# EAGLE design Coco2Composite (EAGLE 9.2.1)
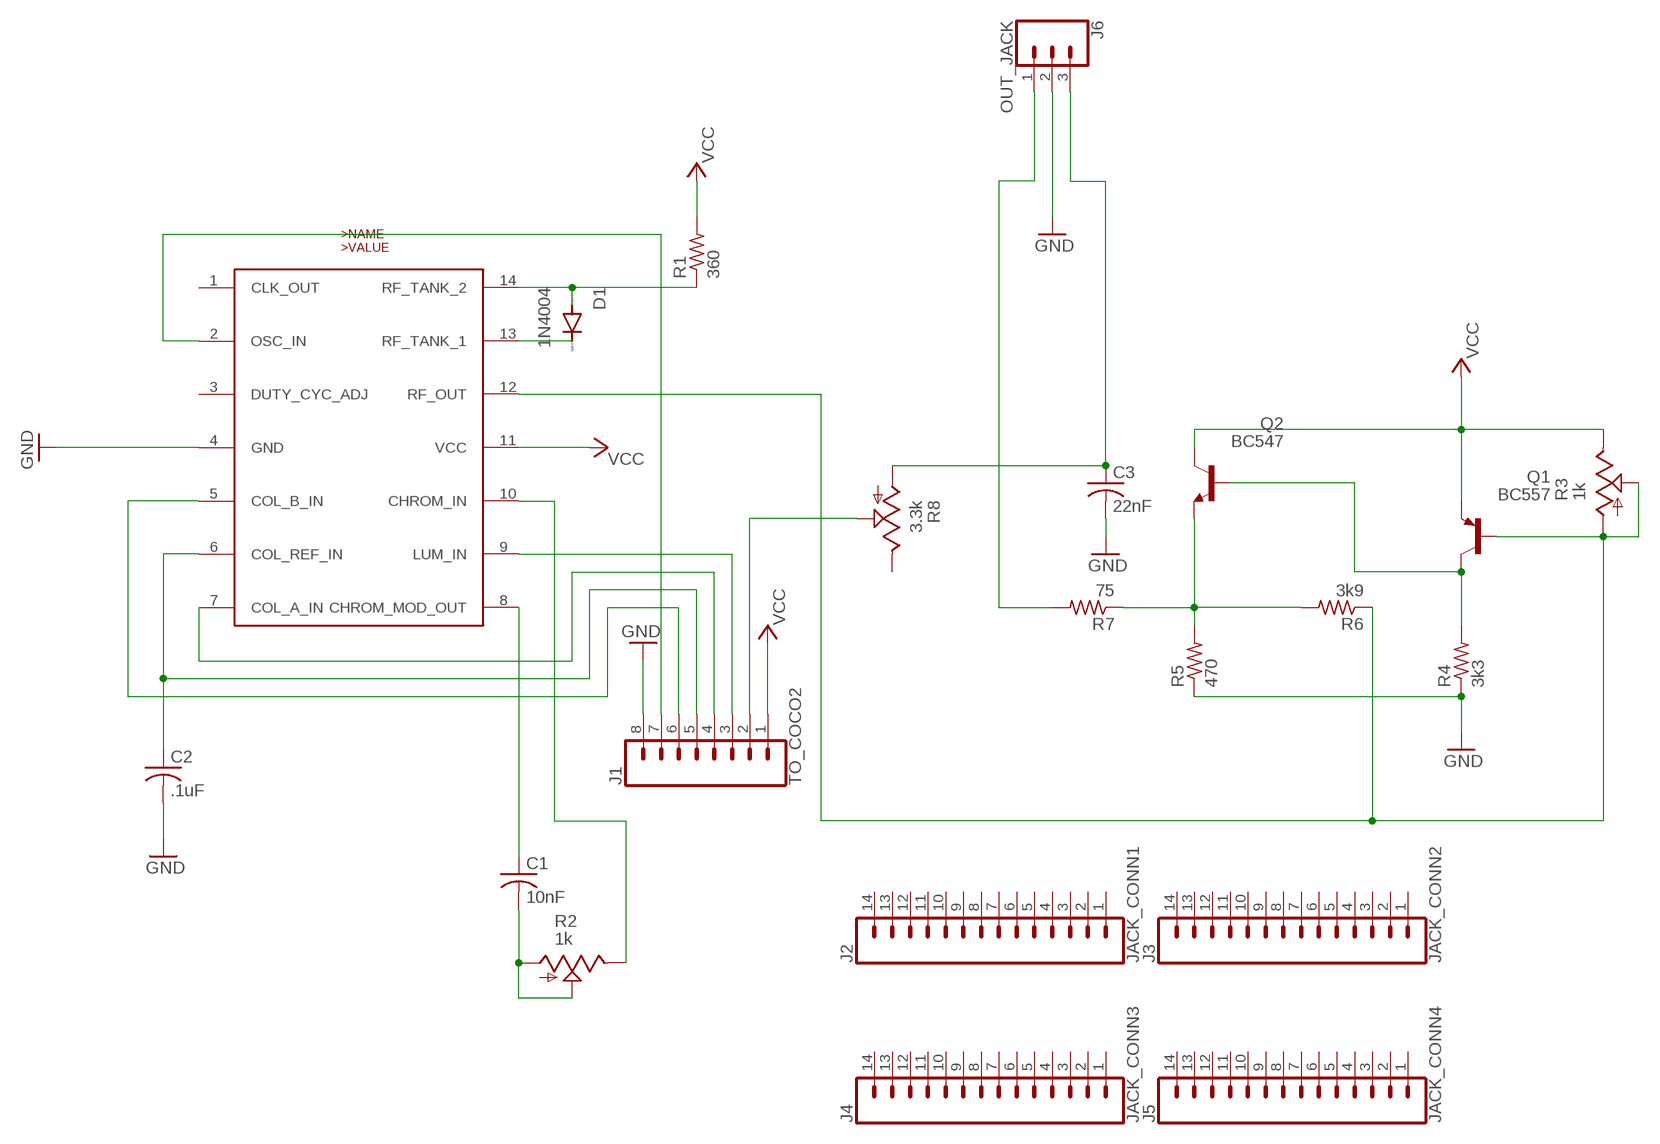
[diagram p0: schematic, sheet 1]

## Parts
C1  10nF  C-US025-024X044  [C025-024X044]
C2  .1uF  C-US025-024X044  [C025-024X044]
C3  22nF  C-US025-024X044  [C025-024X044]
D1  1N4004  [DO41-10]
J1  TO_COCO2  CONN_08"  [1X08]
J2  JACK_CONN1  CONN_14  [1X14]
J3  JACK_CONN2  CONN_14  [1X14]
J4  JACK_CONN3  CONN_14  [1X14]
J5  JACK_CONN4  CONN_14  [1X14]
J6  OUT_JACK  CONN_03  [1X03]
Q1  BC557  [TO92-EBC]
Q2  BC547  [TO92]
R1  360  R-US_0204/2V  [0204V]
R2  1k  TRIM_US-B25U  [B25U]
R3  1k  TRIM_US-B25U  [B25U]
R4  3k3  R-US_0204/2V  [0204V]
R5  470  R-US_0204/2V  [0204V]
R6  3k9  R-US_0204/2V  [0204V]
R7  75  R-US_0204/2V  [0204V]
R8  3.3k  TRIM_US-B25U  [B25U]
U1  MC1372  [DIP14]

## Nets
CHB: C2.1 J1.5 U1.6(COL_REF_IN)
CLK: J1.7 U1.2(OSC_IN)
GND: C2.2 C3.2 J1.8 J6.2 R4.1 R5.1 U1.4(GND)
N$1: D1.C U1.13(RF_TANK_1)
N$2: D1.A R1.1 U1.14(RF_TANK_2)
N$3: C1.1 U1.8(CHROM_MOD_OUT)
N$4: C1.2 R2.A R2.S
N$5: R2.E U1.10(CHROM_IN)
N$6: Q1.B R3.A R3.S R6.1 U1.12(RF_OUT)
N$7: Q1.C Q2.2(B) R4.2
N$8: Q2.1(E) R5.2 R6.2 R7.1
N$9: J6.1 R7.2
N$10: C3.1 J6.3 R8.A
PHI_A: J1.4 U1.7(COL_A_IN)
PHIB: J1.6 U1.5(COL_B_IN)
SND: J1.2 R8.S
VCC: J1.1 Q1.E Q2.3(C) R1.2 R3.E U1.11(VCC)
Y: J1.3 U1.9(LUM_IN)
Unconnected: J2.1 J2.2 J2.3 J2.4 J2.5 J2.6 J2.7 J2.8 J2.9 J2.10 J2.11 J2.12 J2.13 J2.14 J3.1 J3.2 J3.3 J3.4 J3.5 J3.6 J3.7 J3.8 J3.9 J3.10 J3.11 J3.12 J3.13 J3.14 J4.1 J4.2 J4.3 J4.4 J4.5 J4.6 J4.7 J4.8 J4.9 J4.10 J4.11 J4.12 J4.13 J4.14 J5.1 J5.2 J5.3 J5.4 J5.5 J5.6 J5.7 J5.8 J5.9 J5.10 J5.11 J5.12 J5.13 J5.14 R8.E U1.1(CLK_OUT) U1.3(DUTY_CYC_ADJ)

## Library data of the parts
C1-C3 = resistor:C-US: CAPACITOR, American symbol
D1 = diode:1N4004: DIODE general purpose rectifier, 1 A
J1 = SparkFun-Connectors:CONN_08: Multi connection point. Often used as Generic Header-pin footprint for 0.1 inch spaced/style header connections On any of the 0.1 inch spaced packages, you can populate with these: Break Away Headers - Straight <https://www.sparkfun.com/products/116> (PRT-00116) Break Away Male Headers - Right Angle <https://www.sparkfun.com/products/553> (PRT-00553) Female Headers <https://www.sparkfun.com/products/115> (PRT-00115) Break Away Headers - Machine Pin <https://www.sparkfun.com/products/117> (PRT-00117) Break Away Female Headers - Swiss Machine Pin <https://www.sparkfun.com/products/743> (PRT-00743) Arduino Stackable Header - 8 Pin <https://www.sparkfun.com/products/9279> (PRT-09279) For SCREWTERMINALS and SPRING TERMINALS visit here: Screw Terimnals on SparkFun.com <https://www.sparkfun.com/search/results?term=Screw+Terminals> (5mm/3.5mm/2.54mm spacing) This device is also useful as a general connection point to wire up your design to another part of your project. Our various solder wires solder well into these plated through hole pads. Hook-Up Wire - Assortment (Stranded, 22 AWG) <https://www.sparkfun.com/products/11375> (PRT-11375) Hook-Up Wire - Assortment (Solid Core, 22 AWG) <https://www.sparkfun.com/products/11367> (PRT-11367) View the entire wire category on our website here <https://www.sparkfun.com/categories/141> Special notes: Molex polarized connector foot print use with SKU : PRT-08231 with associated crimp pins and housings. 1MM SMD Version SKU: PRT-10208 NOTES ON THE VARIANTS LOCK and LOCK_LONGPADS... This footprint was designed to help hold the alignment of a through-hole component (i.e. 6-pin header) while soldering it into place. You may notice that each hole has been shifted either up or down by 0.005 of an inch from it's more standard position (which is a perfectly straight line). This slight alteration caused the pins (the squares in the middle) to touch the edges of the holes. Because they are alternating, it causes a "brace" to hold the component in place. 0.005 has proven to be the perfect amount of "off-center" position when using our standard breakaway headers. Although looks a little odd when you look at the bare footprint, once you have a header in there, the alteration is very hard to notice. Also,if you push a header all the way into place, it is covered up entirely on the bottom side.; PROD_ID: CONN-08438
J2-J5 = SparkFun-Connectors:CONN_14: Multi connection point. Often used as Generic Header-pin footprint for 0.1 inch spaced/style header connections On any of the 0.1 inch spaced packages, you can populate with these: Break Away Headers - Straight <https://www.sparkfun.com/products/116> (PRT-00116) Break Away Male Headers - Right Angle <https://www.sparkfun.com/products/553> (PRT-00553) Female Headers <https://www.sparkfun.com/products/115> (PRT-00115) Break Away Headers - Machine Pin <https://www.sparkfun.com/products/117> (PRT-00117) Break Away Female Headers - Swiss Machine Pin <https://www.sparkfun.com/products/743> (PRT-00743) For SCREWTERMINALS and SPRING TERMINALS visit here: Screw Terimnals on SparkFun.com <https://www.sparkfun.com/search/results?term=Screw+Terminals> (5mm/3.5mm/2.54mm spacing) This device is also useful as a general connection point to wire up your design to another part of your project. Our various solder wires solder well into these plated through hole pads. Hook-Up Wire - Assortment (Stranded, 22 AWG) <https://www.sparkfun.com/products/11375> (PRT-11375) Hook-Up Wire - Assortment (Solid Core, 22 AWG) <https://www.sparkfun.com/products/11367> (PRT-11367) View the entire wire category on our website here <https://www.sparkfun.com/categories/141> Special notes: Molex polarized connector foot print use with SKU : PRT-08231 with associated crimp pins and housings. 1MM SMD Version SKU: PRT-10208 NOTES ON THE VARIANTS LOCK and LOCK_LONGPADS... This footprint was designed to help hold the alignment of a through-hole component (i.e. 6-pin header) while soldering it into place. You may notice that each hole has been shifted either up or down by 0.005 of an inch from it's more standard position (which is a perfectly straight line). This slight alteration caused the pins (the squares in the middle) to touch the edges of the holes. Because they are alternating, it causes a "brace" to hold the component in place. 0.005 has proven to be the perfect amount of "off-center" position when using our standard breakaway headers. Although looks a little odd when you look at the bare footprint, once you have a header in there, the alteration is very hard to notice. Also,if you push a header all the way into place, it is covered up entirely on the bottom side.
J6 = SparkFun-Connectors:CONN_03: Multi connection point. Often used as Generic Header-pin footprint for 0.1 inch spaced/style header connections On any of the 0.1 inch spaced packages, you can populate with these: Break Away Headers - Straight <https://www.sparkfun.com/products/116> (PRT-00116) Break Away Male Headers - Right Angle <https://www.sparkfun.com/products/553> (PRT-00553) Female Headers <https://www.sparkfun.com/products/115> (PRT-00115) Break Away Headers - Machine Pin <https://www.sparkfun.com/products/117> (PRT-00117) Break Away Female Headers - Swiss Machine Pin <https://www.sparkfun.com/products/743> (PRT-00743) Stackable Header - 3 Pin (Female, 0.1") <https://www.sparkfun.com/products/13875> (PRT-13875) For SCREWTERMINALS and SPRING TERMINALS visit here: Screw Terimnals on SparkFun.com <https://www.sparkfun.com/search/results?term=Screw+Terminals> (5mm/3.5mm/2.54mm spacing) This device is also useful as a general connection point to wire up your design to another part of your project. Our various solder wires solder well into these plated through hole pads. Hook-Up Wire - Assortment (Stranded, 22 AWG) <https://www.sparkfun.com/products/11375> (PRT-11375) Hook-Up Wire - Assortment (Solid Core, 22 AWG) <https://www.sparkfun.com/products/11367> (PRT-11367) View the entire wire category on our website here <https://www.sparkfun.com/categories/141> Special notes: Molex polarized connector foot print use with SKU : PRT-08232 with associated crimp pins and housings.
Q1 = transistor-pnp:BC557*: PNP Transistror
Q2 = transistor-npn:BC547*: NPN Transistor
R1 R4-R7 = resistor:R-US_: RESISTOR, American symbol
R2 R3 R8 = pot:TRIM_US-: POTENTIOMETER
U1 = COCO2Library:MC1372: MC1372

## Board
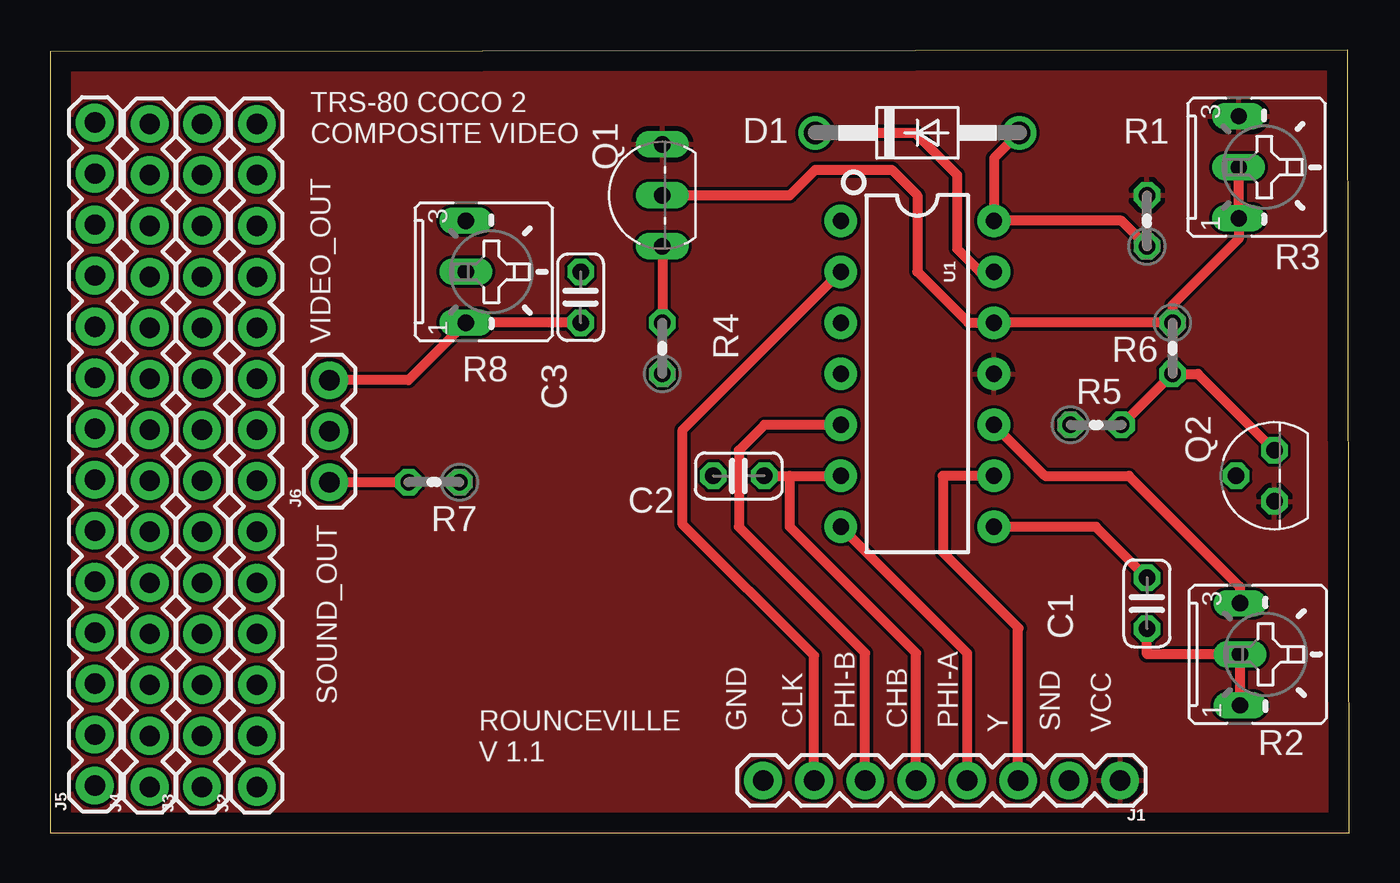
[diagram p1: board, top side]
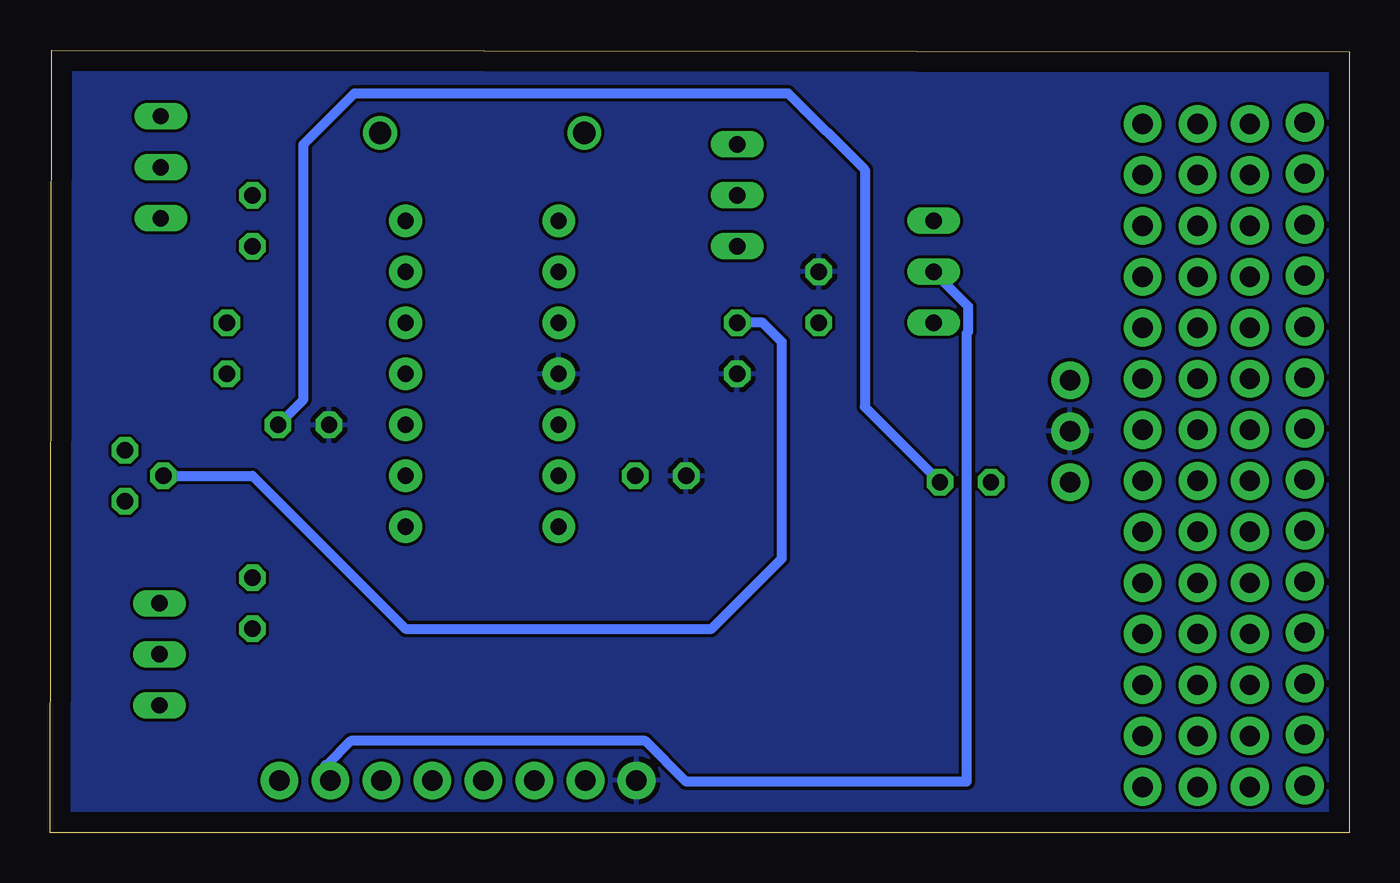
[diagram p2: board, bottom side, seen from below]

Size 64.69 x 38.98 mm. Coordinates in mm from the lower left corner, seen from the top.
Outline: 0,0 64.69,0 64.62,38.98 0,38.91 0,0
Copper layers (1*16): Top 0.035mm / dielectric 1.5mm / Bottom 0.035mm
Design rules "default": minimum track width 6mil, minimum drill 0.35mm, track to track 6mil, track to pad 6mil, pad to pad 6mil, via to via 6mil, smd to smd 6mil, copper to edge 40mil, drill to drill 6mil, minimum pad ring 10mil, minimum via ring 8mil, stop-mask expansion 4mil, vias tented up to drill 0mil, thermal gap 10mil

### Footprints (pad centres in the part's own frame; a part is rotated, then mirrored left to right if it is on the bottom)
C025-024X044 = drill 0.813 octagon: 1 -1.27,0; 2 1.27,0
DO41-10 = drill 1.118: A 5.08,0; C -5.08,0
1X08 = drill 1.016 pad 1.88: 1 0,0; 2 2.54,0; 3 5.08,0; 4 7.62,0; 5 10.16,0; 6 12.7,0; 7 15.24,0; 8 17.78,0
1X14 = drill 1.016 pad 1.88: 1 0,0; 2 2.54,0; 3 5.08,0; 4 7.62,0; 5 10.16,0; 6 12.7,0; 7 15.24,0; 8 17.78,0; 9 20.32,0; 10 22.86,0; 11 25.4,0; 12 27.94,0; 13 30.48,0; 14 33.02,0
1X03 = drill 1.016 pad 1.88: 1 0,0; 2 2.54,0; 3 5.08,0
TO92-EBC = drill 0.813 long: B 0,-1.27; C -2.54,-1.27; E 2.54,-1.27
TO92 = drill 0.813 octagon: 1 1.27,0; 2 0,1.905; 3 -1.27,0
0204V = drill 0.813 octagon: 1 -1.27,0; 2 1.27,0
B25U = drill 0.813 long: A 2.54,-0.889; E -2.54,-0.889; S 0,-0.889
DIP14 = drill 0.813 pad 1.626: 1 -7.62,-3.81; 2 -5.08,-3.81; 3 -2.54,-3.81; 4 0,-3.81; 5 2.54,-3.81; 6 5.08,-3.81; 7 7.62,-3.81; 8 7.62,3.81; 9 5.08,3.81; 10 2.54,3.81; 11 0,3.81; 12 -2.54,3.81; 13 -5.08,3.81; 14 -7.62,3.81

### Placement (x,y rotation side)
C1  54.61,11.43 270 top
C2  34.29,17.78 180 top
C3  26.42,26.67 90 top
D1  43.18,34.86 0 top
J1  53.28,2.6 180 top
J2  10.29,2.29 90 top
J3  7.56,2.29 90 top
J4  4.95,2.29 90 top
J5  2.22,2.35 90 top
J6  13.91,17.46 90 top
Q1  29.21,31.75 90 top
Q2  60.96,17.78 90 top
R1  54.61,30.48 90 top
R2  60.13,8.89 270 top
R3  60.07,33.15 270 top
R4  30.48,24.13 90 top
R5  52.07,20.32 0 top
R6  55.88,24.13 270 top
R7  19.11,17.46 180 top
R8  21.59,27.94 270 top
U1  43.18,22.86 270 top

### Tracks (layer width: path | path; a pad name or v marks a point on that pad's centre or on a via)
CHB
  Top 0.508: C2.1 36.83,17.78 | 36.83,17.78 U1.6 | 36.83,17.78 36.83,15.24 43.12,8.95 J1.5
CLK
  Top 0.508: U1.2 31.5,20.07 31.5,15.37 38.04,8.83 J1.7
GND
  pour Bottom: 0.06,0 65.02,0 65.02,39.43 0.06,39.43
N$1
  Top 0.508: D1.C 43.05,34.86 45.15,32.77 45.15,29.08 46.29,27.94 U1.13
N$2
  Top 0.508: D1.A 46.99,33.59 U1.14 53.34,30.48 R1.1
N$3
  Top 0.508: C1.1 52.07,15.24 U1.8
N$4
  Top 0.508: C1.2 54.61,8.89 R2.S R2.A
N$5
  Top 0.508: U1.10 49.53,17.78 53.72,17.78 59.24,12.26 R2.E
N$6
  Top 0.508: Q1.B 36.83,31.75 38.1,33.02 41.91,33.02 43.18,31.75 43.18,27.94 45.72,25.4 U1.12 R6.1 55.88,26.29 59.18,29.59 R3.A R3.S
N$7
  Top 0.508: Q1.C R4.2
  Bottom 0.508: Q2.2 54.61,17.78 46.99,10.16 31.75,10.16 28.26,13.65 28.26,24.45 29.21,25.4 R4.2
N$8
  Top 0.508: R5.2 R6.2 57.15,22.86 Q2.1
  Bottom 0.508: R5.2 52.07,21.59 52.07,34.29 49.53,36.83 27.94,36.83 24.13,33.02 24.13,21.21 R7.1
N$9
  Top 0.508: J6.1 R7.2
N$10
  Top 0.508: C3.1 R8.A 17.84,22.54 J6.3
PHI_A
  Top 0.508: U1.7 45.66,8.95 J1.4
PHIB
  Top 0.508: U1.5 35.56,20.32 34.29,19.05 34.29,15.24 40.58,8.95 J1.6
SND
  Bottom 0.508: R8.S 18.97,26.21 18.97,24.96 19.05,24.88 19.05,2.54 33.02,2.54 35.05,4.57 49.72,4.57 50.93,3.37 50.99,3.37 50.99,2.86 J1.2
VCC
  pour Top: 0,0 65.28,0 65.28,39.62 0,39.62
Y
  Top 0.508: U1.9 44.45,17.78 44.45,13.97 48.23,10.19 48.2,10.16 J1.3

### Text on the board
tNames: TRS-80 COCO 2 / COMPOSITE VIDEO | VIDEO_OUT | SOUND_OUT | GND | CLK | PHI-B | CHB | PHI-A | Y | SND | VCC | ROUNCEVILLE / V 1.1